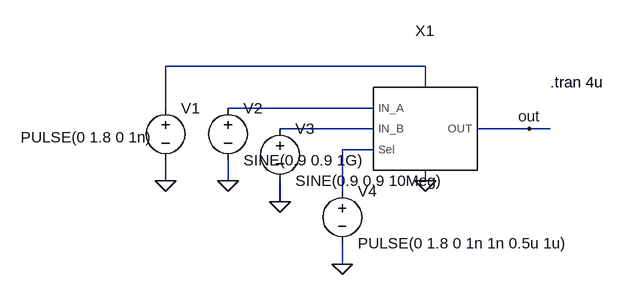
[diagram p0: schematic tb_analog_mux.asc]
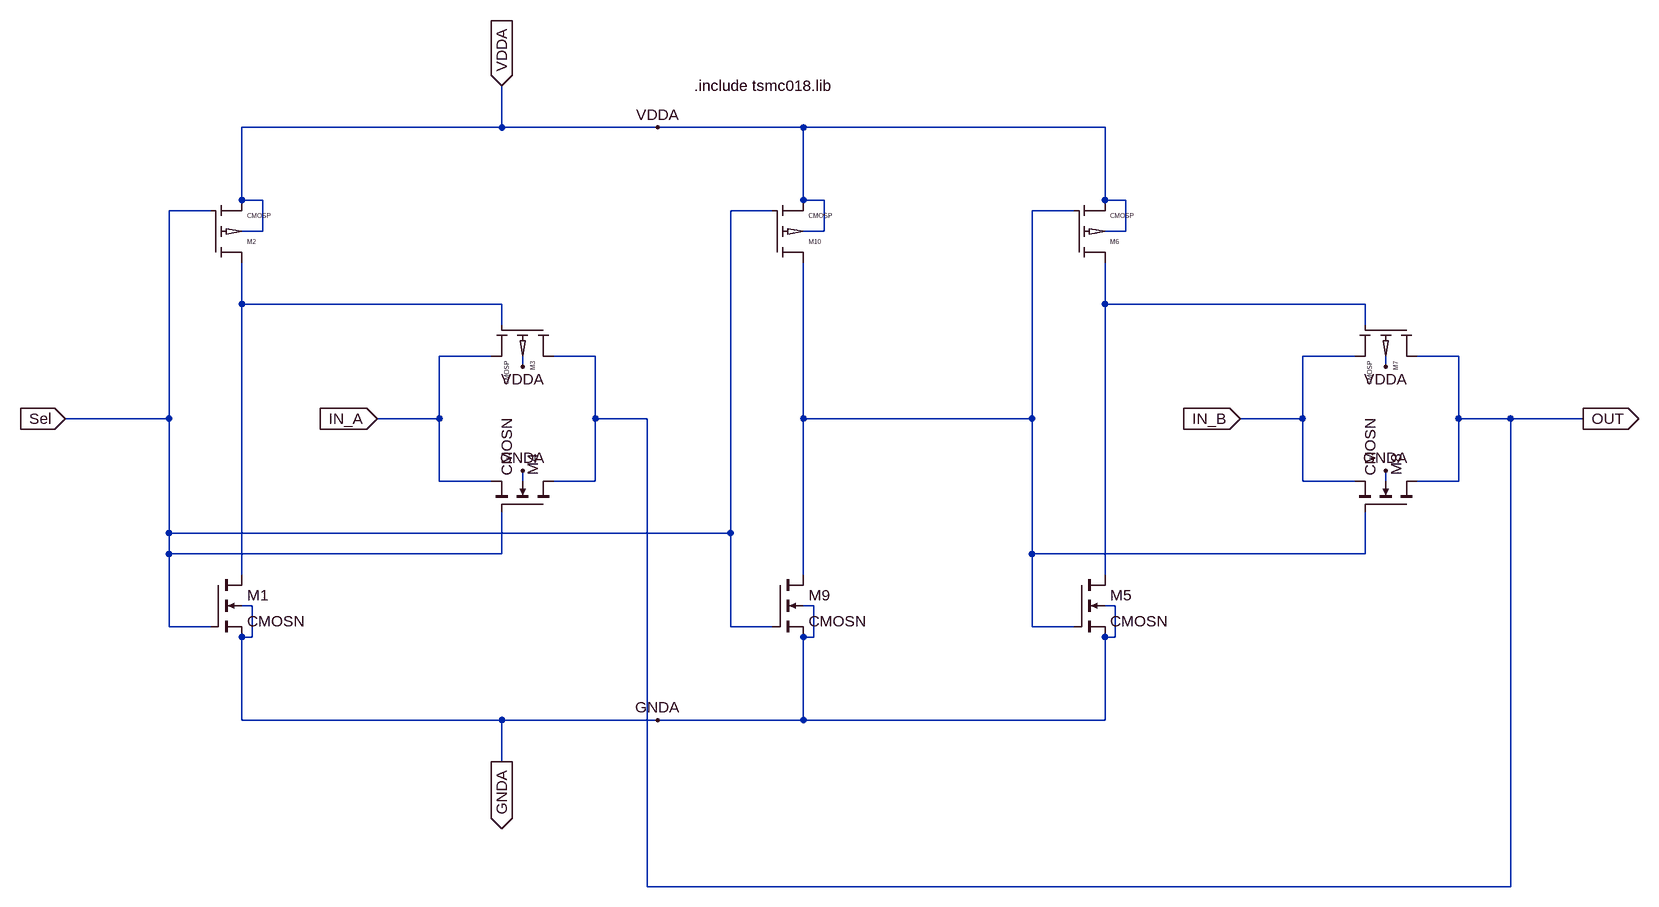
[diagram p1: sub-circuit analog_mux.asc]
tb_analog_mux.asc, the LTspice schematic file:
Version 4
SHEET 1 880 680
WIRE 256 80 -144 80
WIRE 256 112 256 80
WIRE -144 144 -144 80
WIRE 176 144 -48 144
WIRE 176 176 32 176
WIRE 416 176 336 176
WIRE 448 176 416 176
WIRE 176 208 128 208
WIRE -144 256 -144 224
WIRE -48 256 -48 224
WIRE 256 256 256 240
WIRE 128 272 128 208
WIRE 32 288 32 256
WIRE 128 384 128 352
FLAG -144 256 0
FLAG 256 256 0
FLAG -48 256 0
FLAG 32 288 0
FLAG 128 384 0
FLAG 416 176 out
SYMBOL Analog_Mux 256 192 R0
SYMATTR InstName X1
SYMBOL voltage -144 128 R0
WINDOW 3 -223 61 Left 2
WINDOW 123 0 0 Left 0
WINDOW 39 0 0 Left 0
SYMATTR InstName V1
SYMATTR Value PULSE(0 1.8 0 1n)
SYMBOL voltage -48 128 R0
WINDOW 123 0 0 Left 0
WINDOW 39 0 0 Left 0
SYMATTR InstName V2
SYMATTR Value SINE(0.9 0.9 1G)
SYMBOL voltage 32 160 R0
WINDOW 123 0 0 Left 0
WINDOW 39 0 0 Left 0
SYMATTR InstName V3
SYMATTR Value SINE(0.9 0.9 10Meg)
SYMBOL voltage 128 256 R0
WINDOW 123 0 0 Left 0
WINDOW 39 0 0 Left 0
SYMATTR InstName V4
SYMATTR Value PULSE(0 1.8 0 1n 1n 0.5u 1u)
TEXT 448 104 Left 2 !.tran 4u

analog_mux.asc, the sub-circuit schematic file:
Version 4
SHEET 1 2332 772
WIRE 560 -400 560 -464
WIRE 560 -400 160 -400
WIRE 800 -400 560 -400
WIRE 1024 -400 800 -400
WIRE 1488 -400 1024 -400
WIRE 160 -288 160 -400
WIRE 192 -288 160 -288
WIRE 1024 -288 1024 -400
WIRE 1056 -288 1024 -288
WIRE 1488 -288 1488 -400
WIRE 1520 -288 1488 -288
WIRE 112 -272 48 -272
WIRE 976 -272 912 -272
WIRE 1440 -272 1376 -272
WIRE 192 -240 192 -288
WIRE 192 -240 160 -240
WIRE 1056 -240 1056 -288
WIRE 1056 -240 1024 -240
WIRE 1520 -240 1520 -288
WIRE 1520 -240 1488 -240
WIRE 160 -128 160 -192
WIRE 560 -128 160 -128
WIRE 1488 -128 1488 -192
WIRE 1888 -128 1488 -128
WIRE 560 -96 560 -128
WIRE 1888 -96 1888 -128
WIRE 544 -48 464 -48
WIRE 704 -48 640 -48
WIRE 1872 -48 1792 -48
WIRE 2032 -48 1968 -48
WIRE 592 -32 592 -48
WIRE 1920 -32 1920 -48
WIRE 48 48 48 -272
WIRE 48 48 -112 48
WIRE 464 48 464 -48
WIRE 464 48 368 48
WIRE 704 48 704 -48
WIRE 784 48 704 48
WIRE 1024 48 1024 -192
WIRE 1376 48 1376 -272
WIRE 1376 48 1024 48
WIRE 1792 48 1792 -48
WIRE 1792 48 1696 48
WIRE 2032 48 2032 -48
WIRE 2112 48 2032 48
WIRE 2224 48 2112 48
WIRE 464 144 464 48
WIRE 544 144 464 144
WIRE 592 144 592 128
WIRE 704 144 704 48
WIRE 704 144 640 144
WIRE 1792 144 1792 48
WIRE 1872 144 1792 144
WIRE 1920 144 1920 128
WIRE 2032 144 2032 48
WIRE 2032 144 1968 144
WIRE 48 224 48 48
WIRE 912 224 912 -272
WIRE 912 224 48 224
WIRE 48 256 48 224
WIRE 560 256 560 192
WIRE 560 256 48 256
WIRE 1376 256 1376 48
WIRE 1888 256 1888 192
WIRE 1888 256 1376 256
WIRE 160 288 160 -128
WIRE 1024 288 1024 48
WIRE 1488 288 1488 -128
WIRE 176 336 160 336
WIRE 1040 336 1024 336
WIRE 1504 336 1488 336
WIRE 48 368 48 256
WIRE 112 368 48 368
WIRE 912 368 912 224
WIRE 976 368 912 368
WIRE 1376 368 1376 256
WIRE 1440 368 1376 368
WIRE 176 384 176 336
WIRE 176 384 160 384
WIRE 1040 384 1040 336
WIRE 1040 384 1024 384
WIRE 1504 384 1504 336
WIRE 1504 384 1488 384
WIRE 160 512 160 384
WIRE 560 512 160 512
WIRE 800 512 560 512
WIRE 1024 512 1024 384
WIRE 1024 512 800 512
WIRE 1488 512 1488 384
WIRE 1488 512 1024 512
WIRE 560 576 560 512
WIRE 784 768 784 48
WIRE 2112 768 2112 48
WIRE 2112 768 784 768
FLAG 800 -400 VDDA
FLAG 592 -32 VDDA
FLAG 800 512 GNDA
FLAG 592 128 GNDA
FLAG 368 48 IN_A
IOPIN 368 48 In
FLAG 1920 -32 VDDA
FLAG 1920 128 GNDA
FLAG 1696 48 IN_B
IOPIN 1696 48 In
FLAG -112 48 Sel
IOPIN -112 48 In
FLAG 560 -464 VDDA
IOPIN 560 -464 In
FLAG 560 576 GNDA
IOPIN 560 576 Out
FLAG 2224 48 OUT
IOPIN 2224 48 Out
SYMBOL cmosn 112 288 R0
SYMATTR InstName M1
SYMATTR Value2 l=180n w=270n
SYMBOL cmosp 112 -192 M180
SYMATTR InstName M2
SYMATTR Value2 l=180n w=1u
SYMBOL cmosp 640 -96 R90
SYMATTR InstName M3
SYMATTR Value2 l=180n w=1u
SYMBOL cmosn 640 192 M270
SYMATTR InstName M4
SYMATTR Value2 l=180n w=270n
SYMBOL cmosn 1440 288 R0
SYMATTR InstName M5
SYMATTR Value2 l=180n w=270n
SYMBOL cmosp 1440 -192 M180
SYMATTR InstName M6
SYMATTR Value2 l=180n w=1u
SYMBOL cmosp 1968 -96 R90
SYMATTR InstName M7
SYMATTR Value2 l=180n w=1u
SYMBOL cmosn 1968 192 M270
SYMATTR InstName M8
SYMATTR Value2 l=180n w=270n
SYMBOL cmosn 976 288 R0
SYMATTR InstName M9
SYMATTR Value2 l=180n w=270n
SYMBOL cmosp 976 -192 M180
SYMATTR InstName M10
SYMATTR Value2 l=180n w=1u
TEXT 856 -464 Left 2 !.include tsmc018.lib

The netlist it stands for:
* tb_analog_mux.asc
XX1 N002 N003 N004 N001 0 out analog_mux
V1 N001 0 PULSE(0 1.8 0 1n)
V2 N002 0 SINE(0.9 0.9 1G)
V3 N003 0 SINE(0.9 0.9 10Meg)
V4 N004 0 PULSE(0 1.8 0 1n 1n 0.5u 1u)

* block symbol definitions
.subckt analog_mux IN_A IN_B Sel VDDA GNDA OUT
M1 N002 Sel GNDA GNDA CMOSN l=180n w=270n
M2 N002 Sel VDDA VDDA CMOSP l=180n w=1u
M3 OUT N002 IN_A VDDA CMOSP l=180n w=1u
M4 OUT Sel IN_A GNDA CMOSN l=180n w=270n
M5 N003 N001 GNDA GNDA CMOSN l=180n w=270n
M6 N003 N001 VDDA VDDA CMOSP l=180n w=1u
M7 OUT N003 IN_B VDDA CMOSP l=180n w=1u
M8 OUT N001 IN_B GNDA CMOSN l=180n w=270n
M9 N001 Sel GNDA GNDA CMOSN l=180n w=270n
M10 N001 Sel VDDA VDDA CMOSP l=180n w=1u
.include tsmc018.lib
.ends analog_mux

.model NMOS NMOS
.model PMOS PMOS
.lib standard.mos
.tran 4u
.lib tsmc018.lib
.backanno
.end